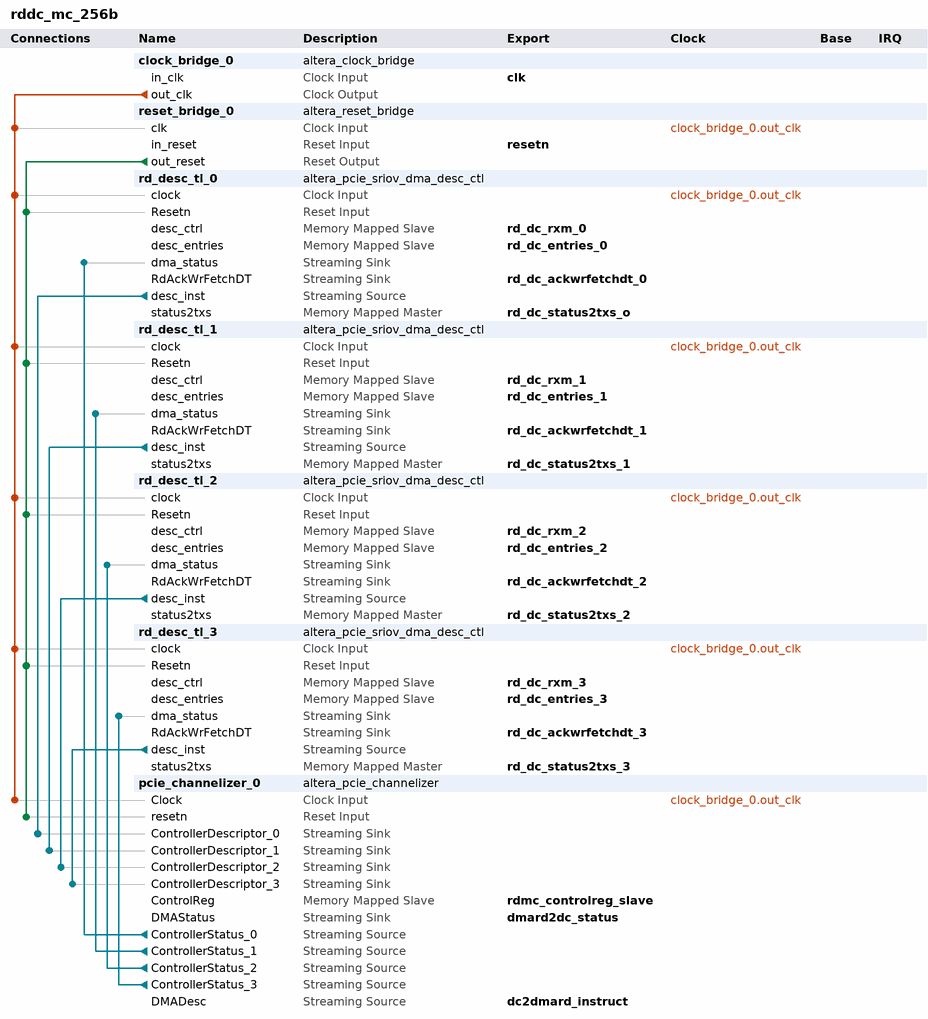
[diagram p0: system contents]
# Platform Designer (Qsys) system rddc_mc_256b, Stratix V Unknown
# Parameters at their usual value, and those the tool derives, are not listed.
package require -exact qsys 14.1
create_system rddc_mc_256b
set_project_property DEVICE_FAMILY {Stratix V}
set_project_property DEVICE Unknown

add_instance clock_bridge_0 altera_clock_bridge 14.1
set_instance_parameter_value clock_bridge_0 DERIVED_CLOCK_RATE 0
set_instance_parameter_value clock_bridge_0 EXPLICIT_CLOCK_RATE 250

add_instance reset_bridge_0 altera_reset_bridge 14.1
set_instance_parameter_value reset_bridge_0 ACTIVE_LOW_RESET 1
set_instance_parameter_value reset_bridge_0 SYNCHRONOUS_EDGES deassert

add_instance rd_desc_tl_0 altera_pcie_sriov_dma_desc_ctl 14.1
set_instance_parameter_value rd_desc_tl_0 CHANNELIZER_ENABLE 1
set_instance_parameter_value rd_desc_tl_0 DMA_WIDTH 256
set_instance_parameter_value rd_desc_tl_0 FUNC_NUM 128
set_instance_parameter_value rd_desc_tl_0 READ_CONTROL 1
set_instance_parameter_value rd_desc_tl_0 USER_STATUS 0

add_instance rd_desc_tl_1 altera_pcie_sriov_dma_desc_ctl 14.1
set_instance_parameter_value rd_desc_tl_1 CHANNELIZER_ENABLE 1
set_instance_parameter_value rd_desc_tl_1 DMA_WIDTH 256
set_instance_parameter_value rd_desc_tl_1 FUNC_NUM 129
set_instance_parameter_value rd_desc_tl_1 READ_CONTROL 1
set_instance_parameter_value rd_desc_tl_1 USER_STATUS 0

add_instance rd_desc_tl_2 altera_pcie_sriov_dma_desc_ctl 14.1
set_instance_parameter_value rd_desc_tl_2 CHANNELIZER_ENABLE 1
set_instance_parameter_value rd_desc_tl_2 DMA_WIDTH 256
set_instance_parameter_value rd_desc_tl_2 FUNC_NUM 130
set_instance_parameter_value rd_desc_tl_2 READ_CONTROL 1
set_instance_parameter_value rd_desc_tl_2 USER_STATUS 0

add_instance rd_desc_tl_3 altera_pcie_sriov_dma_desc_ctl 14.1
set_instance_parameter_value rd_desc_tl_3 CHANNELIZER_ENABLE 1
set_instance_parameter_value rd_desc_tl_3 DMA_WIDTH 256
set_instance_parameter_value rd_desc_tl_3 FUNC_NUM 131
set_instance_parameter_value rd_desc_tl_3 READ_CONTROL 1
set_instance_parameter_value rd_desc_tl_3 USER_STATUS 0

add_instance pcie_channelizer_0 altera_pcie_channelizer 14.1
set_instance_parameter_value pcie_channelizer_0 DESC_WIDTH 169
set_instance_parameter_value pcie_channelizer_0 NUMBER_OF_CHANNELS 4
set_instance_parameter_value pcie_channelizer_0 PRIORITY_WEIGHT 4
set_instance_parameter_value pcie_channelizer_0 pcie_qsys 1

# connections
add_connection clock_bridge_0.out_clk pcie_channelizer_0.Clock clock
add_connection clock_bridge_0.out_clk rd_desc_tl_0.clock clock
add_connection clock_bridge_0.out_clk rd_desc_tl_1.clock clock
add_connection clock_bridge_0.out_clk rd_desc_tl_2.clock clock
add_connection clock_bridge_0.out_clk rd_desc_tl_3.clock clock
add_connection clock_bridge_0.out_clk reset_bridge_0.clk clock
add_connection reset_bridge_0.out_reset pcie_channelizer_0.resetn reset
add_connection reset_bridge_0.out_reset rd_desc_tl_0.Resetn reset
add_connection reset_bridge_0.out_reset rd_desc_tl_1.Resetn reset
add_connection reset_bridge_0.out_reset rd_desc_tl_2.Resetn reset
add_connection reset_bridge_0.out_reset rd_desc_tl_3.Resetn reset
add_connection pcie_channelizer_0.ControllerStatus_0 rd_desc_tl_0.dma_status avalon_streaming
add_connection pcie_channelizer_0.ControllerStatus_1 rd_desc_tl_1.dma_status avalon_streaming
add_connection pcie_channelizer_0.ControllerStatus_2 rd_desc_tl_2.dma_status avalon_streaming
add_connection pcie_channelizer_0.ControllerStatus_3 rd_desc_tl_3.dma_status avalon_streaming
add_connection rd_desc_tl_0.desc_inst pcie_channelizer_0.ControllerDescriptor_0 avalon_streaming
add_connection rd_desc_tl_1.desc_inst pcie_channelizer_0.ControllerDescriptor_1 avalon_streaming
add_connection rd_desc_tl_2.desc_inst pcie_channelizer_0.ControllerDescriptor_2 avalon_streaming
add_connection rd_desc_tl_3.desc_inst pcie_channelizer_0.ControllerDescriptor_3 avalon_streaming

# exported interfaces
add_interface clk clock sink
set_interface_property clk EXPORT_OF clock_bridge_0.in_clk
add_interface dc2dmard_instruct avalon_streaming source
set_interface_property dc2dmard_instruct EXPORT_OF pcie_channelizer_0.DMADesc
add_interface dmard2dc_status avalon_streaming sink
set_interface_property dmard2dc_status EXPORT_OF pcie_channelizer_0.DMAStatus
add_interface rd_dc_ackwrfetchdt_0 avalon_streaming sink
set_interface_property rd_dc_ackwrfetchdt_0 EXPORT_OF rd_desc_tl_0.RdAckWrFetchDT
add_interface rd_dc_ackwrfetchdt_1 avalon_streaming sink
set_interface_property rd_dc_ackwrfetchdt_1 EXPORT_OF rd_desc_tl_1.RdAckWrFetchDT
add_interface rd_dc_ackwrfetchdt_2 avalon_streaming sink
set_interface_property rd_dc_ackwrfetchdt_2 EXPORT_OF rd_desc_tl_2.RdAckWrFetchDT
add_interface rd_dc_ackwrfetchdt_3 avalon_streaming sink
set_interface_property rd_dc_ackwrfetchdt_3 EXPORT_OF rd_desc_tl_3.RdAckWrFetchDT
add_interface rd_dc_entries_0 avalon slave
set_interface_property rd_dc_entries_0 EXPORT_OF rd_desc_tl_0.desc_entries
add_interface rd_dc_entries_1 avalon slave
set_interface_property rd_dc_entries_1 EXPORT_OF rd_desc_tl_1.desc_entries
add_interface rd_dc_entries_2 avalon slave
set_interface_property rd_dc_entries_2 EXPORT_OF rd_desc_tl_2.desc_entries
add_interface rd_dc_entries_3 avalon slave
set_interface_property rd_dc_entries_3 EXPORT_OF rd_desc_tl_3.desc_entries
add_interface rd_dc_rxm_0 avalon slave
set_interface_property rd_dc_rxm_0 EXPORT_OF rd_desc_tl_0.desc_ctrl
add_interface rd_dc_rxm_1 avalon slave
set_interface_property rd_dc_rxm_1 EXPORT_OF rd_desc_tl_1.desc_ctrl
add_interface rd_dc_rxm_2 avalon slave
set_interface_property rd_dc_rxm_2 EXPORT_OF rd_desc_tl_2.desc_ctrl
add_interface rd_dc_rxm_3 avalon slave
set_interface_property rd_dc_rxm_3 EXPORT_OF rd_desc_tl_3.desc_ctrl
add_interface rd_dc_status2txs_1 avalon master
set_interface_property rd_dc_status2txs_1 EXPORT_OF rd_desc_tl_1.status2txs
add_interface rd_dc_status2txs_2 avalon master
set_interface_property rd_dc_status2txs_2 EXPORT_OF rd_desc_tl_2.status2txs
add_interface rd_dc_status2txs_3 avalon master
set_interface_property rd_dc_status2txs_3 EXPORT_OF rd_desc_tl_3.status2txs
add_interface rd_dc_status2txs_o avalon master
set_interface_property rd_dc_status2txs_o EXPORT_OF rd_desc_tl_0.status2txs
add_interface rdmc_controlreg_slave avalon slave
set_interface_property rdmc_controlreg_slave EXPORT_OF pcie_channelizer_0.ControlReg
add_interface resetn reset sink
set_interface_property resetn EXPORT_OF reset_bridge_0.in_reset

set_interconnect_requirement {$system} qsys_mm.clockCrossingAdapter HANDSHAKE
set_interconnect_requirement {$system} qsys_mm.insertDefaultSlave false
set_interconnect_requirement {$system} qsys_mm.maxAdditionalLatency 1

save_system rddc_mc_256b.qsys
